# EAGLE design qo-100-pa (EAGLE 9.6.1)
CREVISION: 1; DESIGNER: Joao Silva
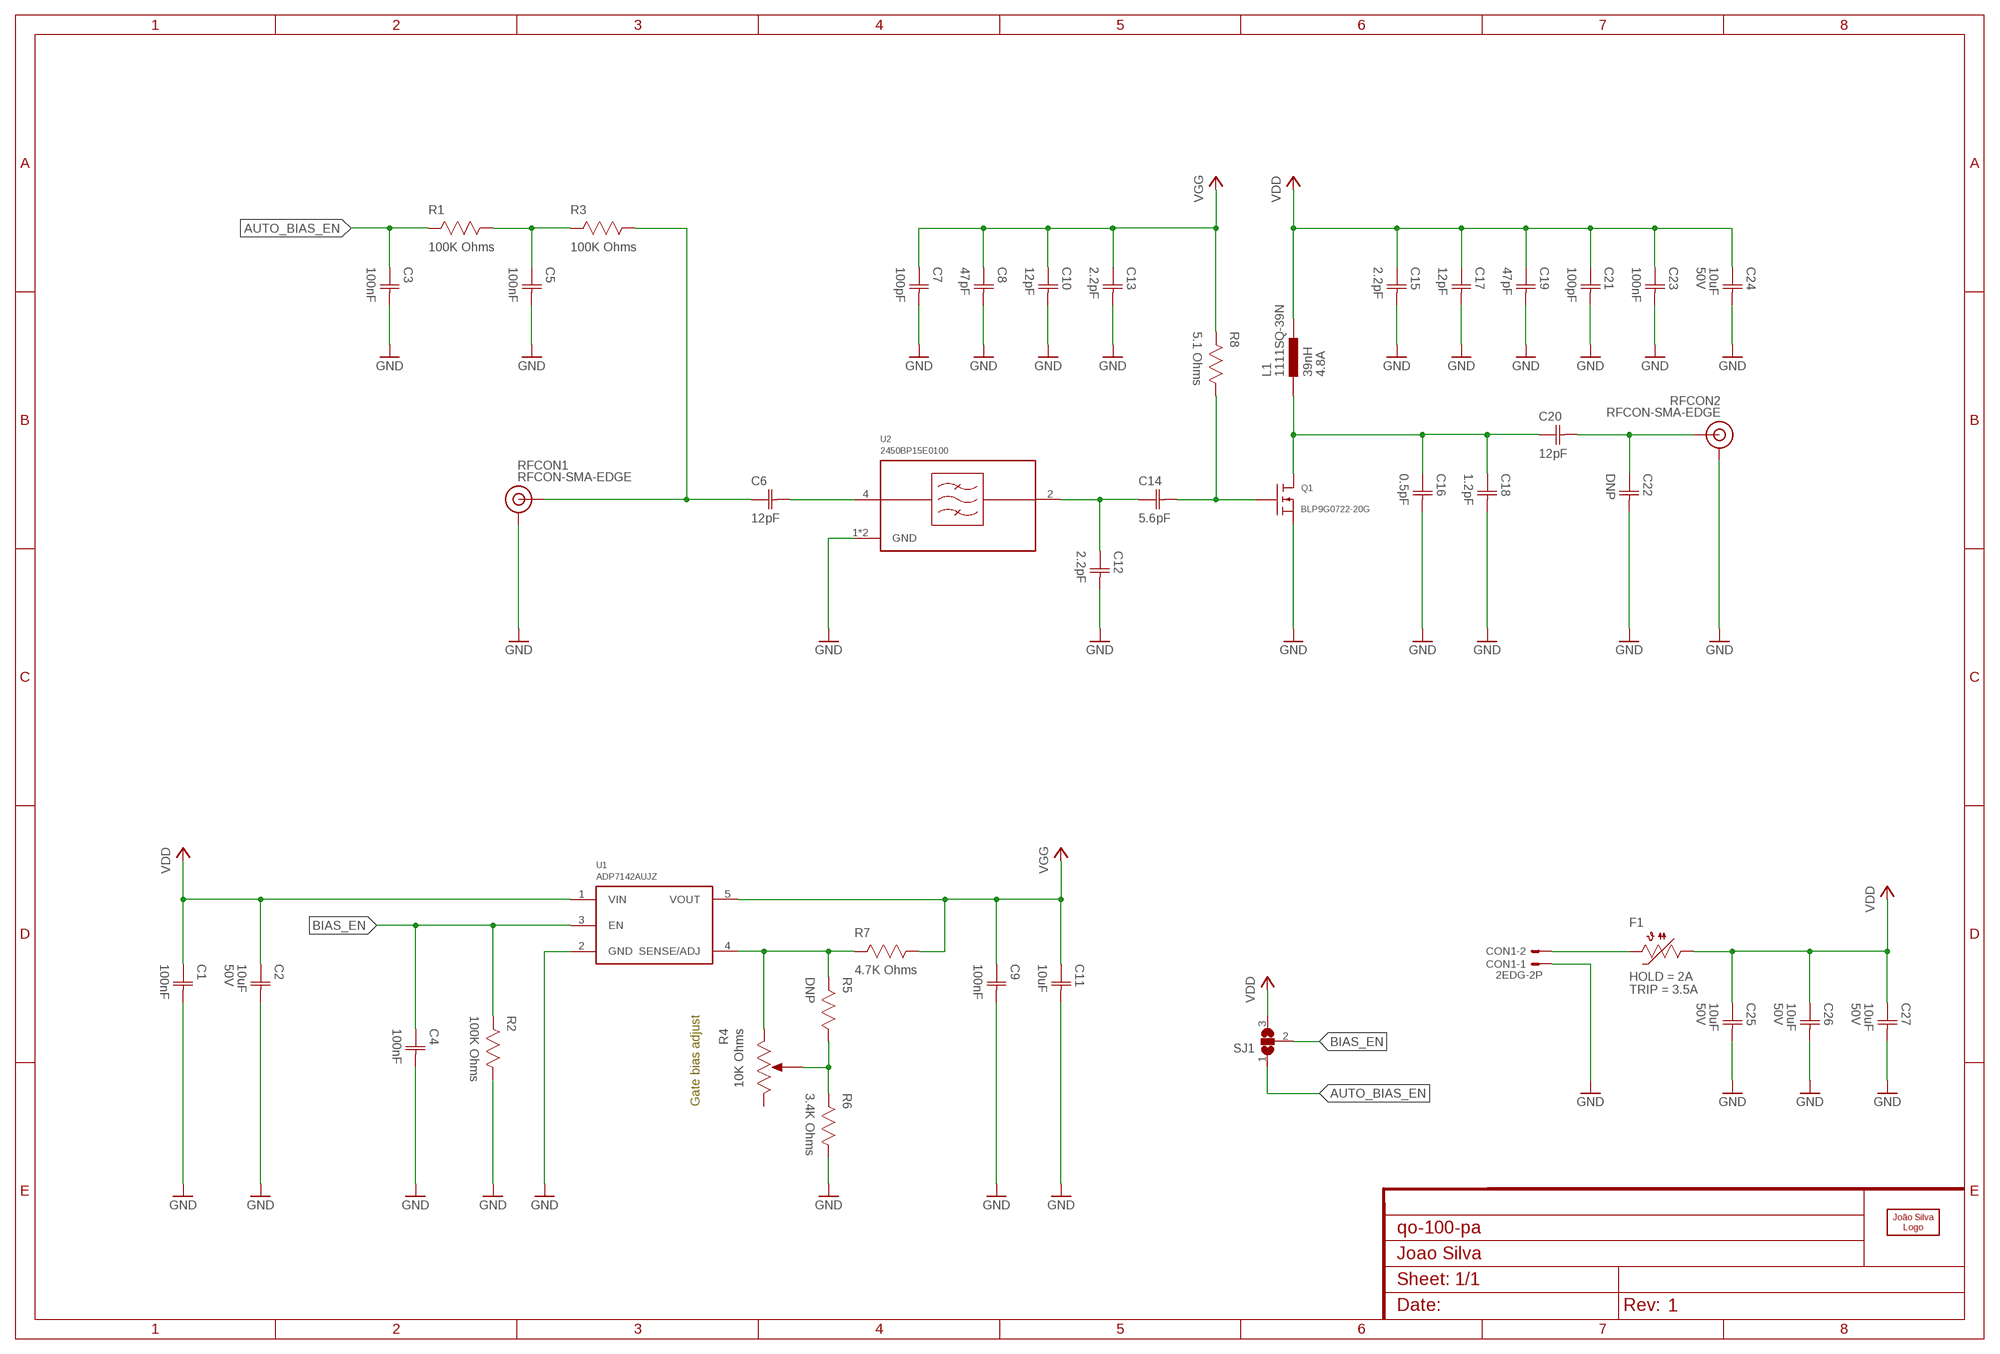
[diagram p0: schematic, sheet 1]

## Parts
C1  100nF  CAPACITOR-0603  [CAP0603]
C2  10uF  CAPACITOR-1206  [CAP1206]
C3  100nF  CAPACITOR-0603  [CAP0603]
C4  100nF  CAPACITOR-0603  [CAP0603]
C5  100nF  CAPACITOR-0603  [CAP0603]
C6  12pF  CAPACITOR-0603  [CAP0603]
C7  100pF  CAPACITOR-0603  [CAP0603]
C8  47pF  CAPACITOR-0603  [CAP0603]
C9  100nF  CAPACITOR-0603  [CAP0603]
C10  12pF  CAPACITOR-0603  [CAP0603]
C11  10uF  CAPACITOR-0603  [CAP0603]
C12  2.2pF  CAPACITOR-0603  [CAP0603]
C13  2.2pF  CAPACITOR-0603  [CAP0603]
C14  5.6pF  CAPACITOR-0603  [CAP0603]
C15  2.2pF  CAPACITOR-0603  [CAP0603]
C16  0.5pF  CAPACITOR-0603  [CAP0603]
C17  12pF  CAPACITOR-0603  [CAP0603]
C18  1.2pF  CAPACITOR-0603  [CAP0603]
C19  47pF  CAPACITOR-0603  [CAP0603]
C20  12pF  CAPACITOR-0603  [CAP0603]
C21  100pF  CAPACITOR-0603  [CAP0603]
C22  DNP  CAPACITOR-0603  [CAP0603]
C23  100nF  CAPACITOR-0603  [CAP0603]
C24  10uF  CAPACITOR-1206  [CAP1206]
C25  10uF  CAPACITOR-1206  [CAP1206]
C26  10uF  CAPACITOR-1206  [CAP1206]
C27  10uF  CAPACITOR-1206  [CAP1206]
CON1  2EDG-2P  [2EDG-2P]
F1  PTC1206  [1206]
L1  39nH  1111SQ-39N  [1111SQ]
LOGO1  JS-10MM  [JS_10MM]
Q1  BLP9G0722-20G  [SOT1483-1]
R1  100K Ohms  RESISTOR-0603  [RES0603]
R2  100K Ohms  RESISTOR-0603  [RES0603]
R3  100K Ohms  RESISTOR-0603  [RES0603]
R4  10K Ohms  POTENTIOMETER-SMD-3X3  [POT3MM]
R5  DNP  RESISTOR-0603  [RES0603]
R6  3.4K Ohms  RESISTOR-0603  [RES0603]
R7  4.7K Ohms  RESISTOR-0603  [RES0603]
R8  5.1 Ohms  RESISTOR-0603  [RES0603]
RFCON1  RFCON-SMA-EDGE  [SMA-EDGE]
RFCON2  RFCON-SMA-EDGE  [SMA-EDGE]
SJ1  SJ2S  [SJ2_S]
U1  ADP7142AUJZ  [SOT23-5]
U2  2450BP15E0100  [2450BP15E0100]

## Nets
AUTO_BIAS_EN: C3.1(C1) R1.2 SJ1.1
BIAS_EN: C4.1(C1) R2.2 SJ1.2 U1.3(EN)
GND: C1.2(C2) C2.2(C2) C3.2(C2) C4.2(C2) C5.2(C2) C7.2(C2) C8.2(C2) C9.2(C2) C10.2(C2) C11.2(C2) C12.2(C2) C13.2(C2) C15.2(C2) C16.2(C2) C17.2(C2) C18.2(C2) C19.2(C2) C21.2(C2) C22.2(C2) C23.2(C2) C24.2(C2) C25.2(C2) C26.2(C2) C27.2(C2) CON1.P$1 Q1.3@0(S) Q1.3@1(S) Q1.3@2(S) R2.1 R6.1 RFCON1.GND@0(GND) RFCON1.GND@1(GND) RFCON1.GND@2(GND) RFCON1.GND@3(GND) RFCON2.GND@0(GND) RFCON2.GND@1(GND) RFCON2.GND@2(GND) RFCON2.GND@3(GND) U1.2(GND) U2.1(GND) U2.3(GND)
N$1 [HV isolation]: CON1.P$2 F1.2
N$2: C14.2(C2) Q1.2(G) R8.1
N$3: C16.1(C1) C18.1(C1) C20.1(C1) L1.1 Q1.1(D)
N$4: C20.2(C2) C22.1(C1) RFCON2.SIG(SIGNAL)
N$5: C12.1(C1) C14.1(C1) U2.2(RFOUT)
N$6: C6.2(C2) U2.4(RFIN)
N$7: C5.1(C1) R1.1 R3.2
N$8: R4.1(CCW) R5.2 R7.2 U1.4(SENSE/ADJ)
N$9: R4.2(WIPER) R5.1 R6.2
N$12: C6.1(C1) R3.1 RFCON1.SIG(SIGNAL)
VDD [HV isolation]: C1.1(C1) C2.1(C1) C15.1(C1) C17.1(C1) C19.1(C1) C21.1(C1) C23.1(C1) C24.1(C1) C25.1(C1) C26.1(C1) C27.1(C1) F1.1 L1.2 SJ1.3 U1.1(VIN)
VGG: C7.1(C1) C8.1(C1) C9.1(C1) C10.1(C1) C11.1(C1) C13.1(C1) R7.1 R8.2 U1.5(VOUT)
Unconnected: R4.3(CW)

## Notes on the sheet
- Gate bias adjust

## Library data of the parts
C1 C3-C23 = Capacitor:CAPACITOR
C2 C24-C27 = Capacitor:CAPACITOR; VOLTAGE: 50V
CON1 = Generic Connector:2EDG-2P
F1 = PTC Fuses:PTC; HOLD: 2A; TRIP: 3.5A
L1 = Coilcraft:1111SQ-; CURRENT: 4.8A; REF: 1111SQ-39N
LOGO1 = Silkscreen:JS
Q1 = Ampleon:BLP9G0722-20
R1-R3 R5-R8 = Resistor:RESISTOR
R4 = Potentiometer:POTENTIOMETER
RFCON1 RFCON2 = RF Connector:RFCON
SJ1 = Solder Jumper:SJ2
U1 = Analog Devices:ADP7142AUJZ*
U2 = Generic Filter:2450BP15E0100

## Net classes
1 HV isolation: clearance 0.2 mm

## Board
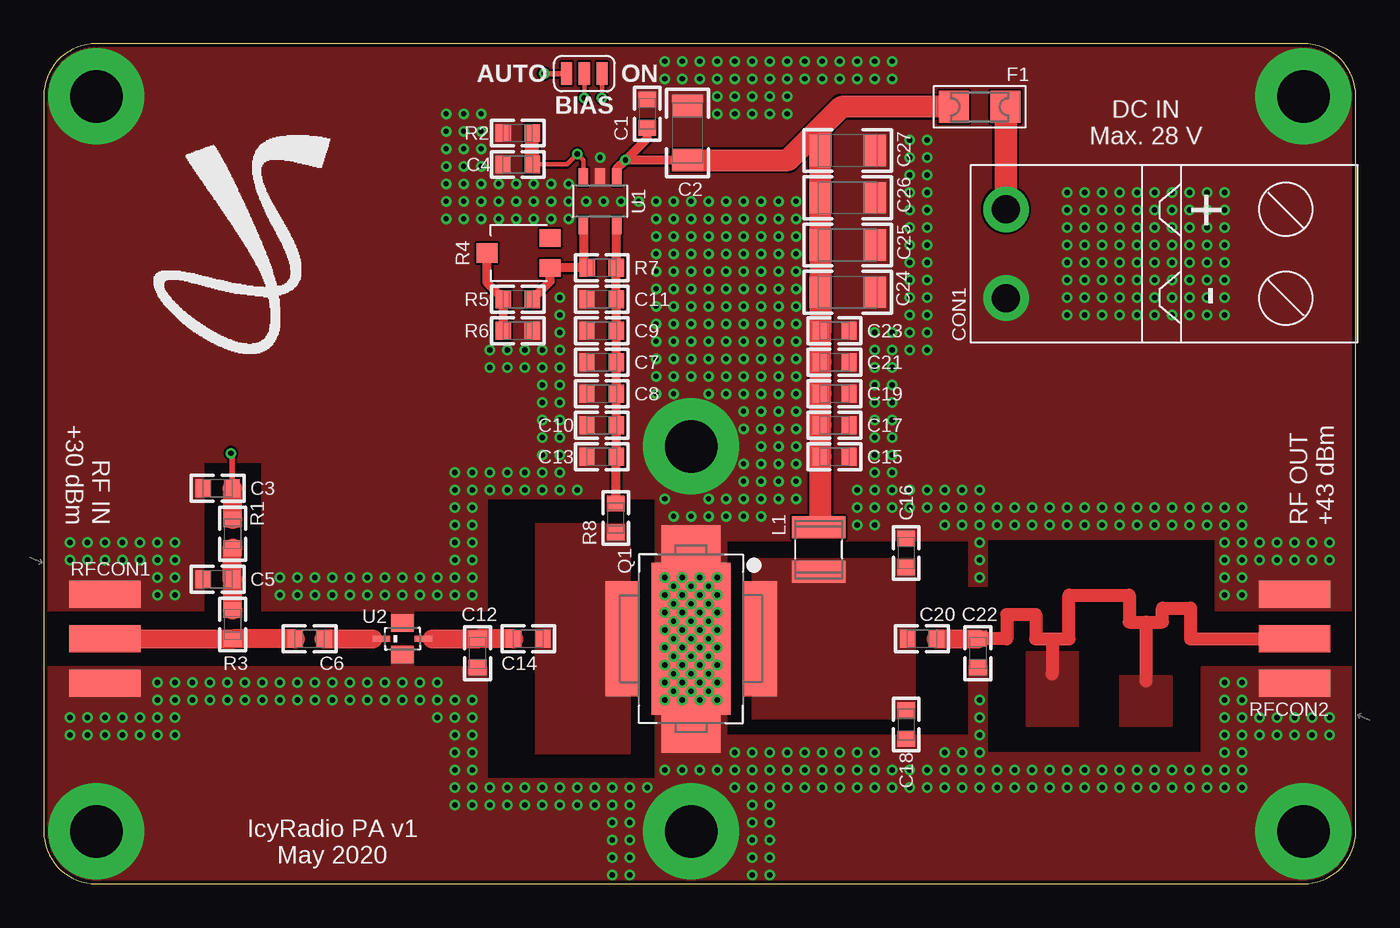
[diagram p1: board, top side]
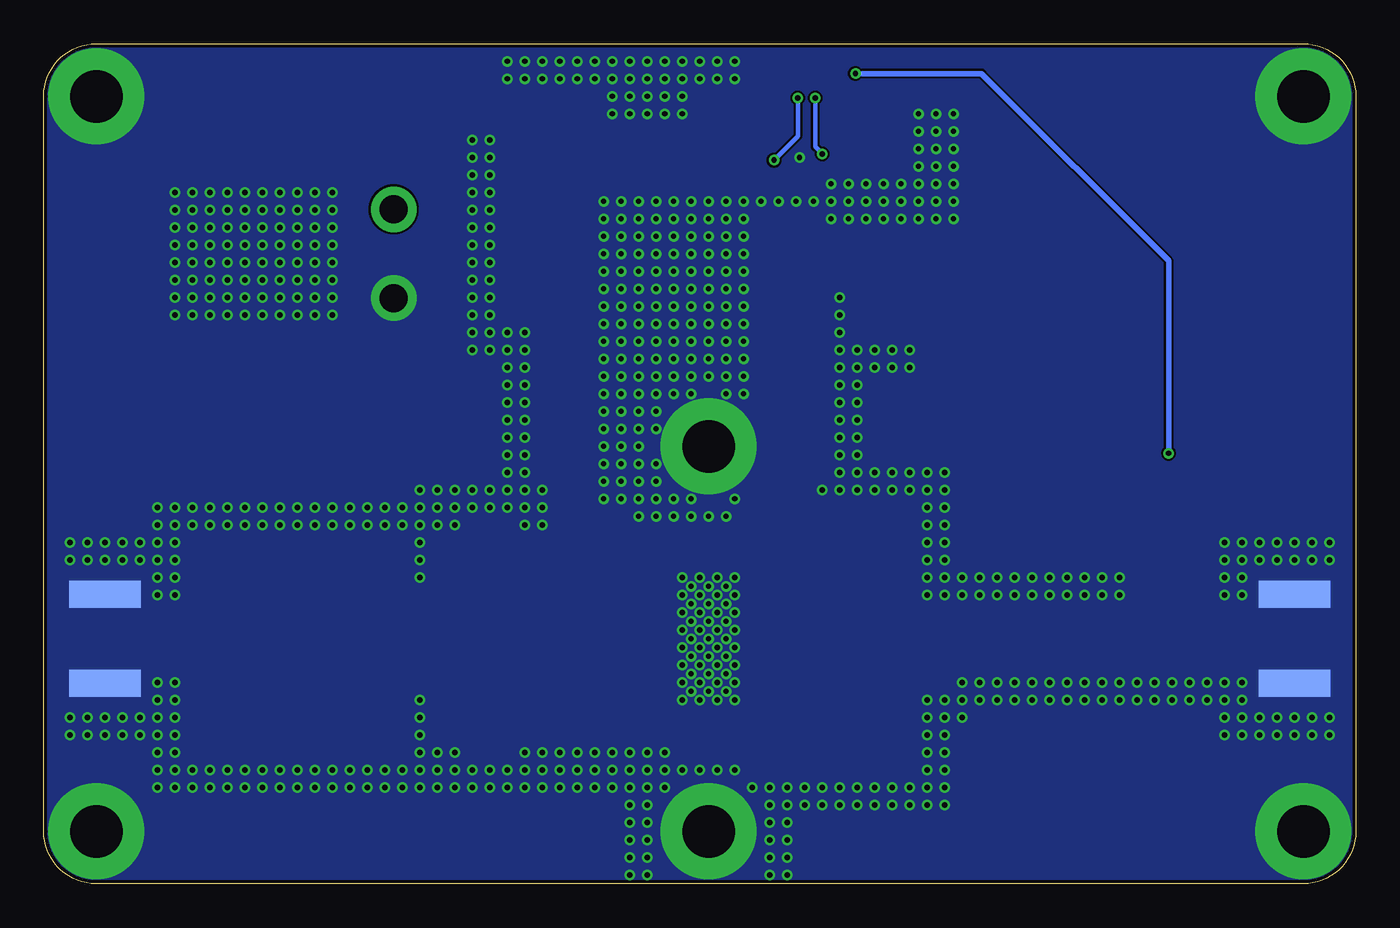
[diagram p2: board, bottom side, seen from below]

Size 75 x 48 mm. Coordinates in mm from the lower left corner, seen from the top.
Outline: 72,48 3,48 arc90 0,45 0,3 arc90 3,0 72,0 arc90 75,3 75,45 arc90 72,48
Copper layers (1*16): Top 0.035mm / dielectric 1.6mm / Bottom 0.035mm
Design rules "jlcpcb_2layer": minimum track width 5mil, minimum drill 0.3mm, track to track 5mil, track to pad 5mil, pad to pad 5mil, via to via 5mil, smd to smd 5mil, copper to edge 0.2mm, drill to drill 5mil, minimum pad ring 3mil, minimum via ring 3mil, stop-mask expansion 0.075mm, vias tented up to drill 10mm, thermal gap 5mil

### Footprints (pad centres in the part's own frame; a part is rotated, then mirrored left to right if it is on the bottom)
CAP0603 = smd 0.889 x 1.016: 1 -0.819,0; 2 0.819,0
CAP1206 = smd 1.27 x 1.778: 1 -1.549,0; 2 1.549,0
2EDG-2P = drill 1.6 pad 2.6: P$1 -2.54,0; P$2 2.54,0
1206 = smd 1.7 x 1.803: 1 -1.472,0; 2 1.472,0
1111SQ = smd 1.27 x 3.05: 1 -1.27,0; 2 1.27,0
SOT1483-1 = smd 6.55 x 1.9: 1 0,-3.95; 2 0,3.95 | smd 2.4 x 3.38: 3@0 5.3,0; 3@1 -5.3,0 | smd 8.7 x 4.5: 3@2 0,0
RES0603 = smd 0.889 x 1.016: 1 -0.819,0; 2 0.819,0
POT3MM = smd 1 x 1.2: 1 -0.85,-1.8; 3 0.85,-1.8 | smd 1.1 x 1.2: 2 0,1.8
SMA-EDGE = smd 1.524 x 4.064: GND@0 -2.54,0; GND@1 2.54,0; SIG 0,0 | smd 1.524 x 4.064 bottom: GND@2 -2.54,0; GND@3 2.54,0
SJ2_S = smd 0.635 x 1.27: 1 -1.016,0; 2 0,0; 3 1.016,0
SOT23-5 = smd 1 x 0.55: 1 -1.4,0.95; 2 -1.4,0; 3 -1.4,-0.95; 4 1.4,-0.95; 5 1.4,0.95
2450BP15E0100 = smd 1.3 x 1: 1 0,0.9; 3 0,-0.9 | smd 1 x 0.35: 2 1.2,0; 4 -1.2,0

### Placement (x,y rotation side)
C1  34.5,44 90 top
C2  36.8,42.9 90 top
C3  9.95,22.6 180 top
C4  27.1,41.1 180 top
C5  9.95,17.4 180 top
C6  15.2,14 0 top
C7  31.9,29.8 180 top
C8  31.9,28 180 top
C9  31.9,31.6 180 top
C10  31.9,26.2 180 top
C11  31.9,33.4 180 top
C12  24.8,13.18 270 top
C13  31.9,24.4 180 top
C14  27.7,14 0 top
C15  45.2,24.4 0 top
C16  49.3,18.9 90 top
C17  45.2,26.2 0 top
C18  49.3,9.1 270 top
C19  45.2,28 0 top
C20  50.2,14 0 top
C21  45.2,29.8 0 top
C22  53.4,13.18 270 top
C23  45.2,31.6 0 top
C24  45.95,33.8 0 top
C25  45.95,36.5 0 top
C26  45.95,39.2 0 top
C27  45.95,41.9 0 top
CON1  55,36 90 top
F1  53.5,44.4 0 top
L1  44.3,19.1 90 top
LOGO1  17.3,43.3 0 top
Q1  37,14 90 top
R1  10.8,20 90 top
R2  27.1,42.9 0 top
R3  10.8,14.81 90 top
R4  27.15,36.05 90 top
R5  27.1,33.4 0 top
R6  27.1,31.6 180 top
R7  31.9,35.2 180 top
R8  32.7,20.9 90 top
RFCON1  3.5,14 270 top
RFCON2  71.5,14 90 top
SJ1  30.9,46.3 0 top
U1  31.8,39 270 top
U2  20.5,14 0 top

### Tracks (layer width: path | path; a pad name or v marks a point on that pad's centre or on a via)
AUTO_BIAS_EN  (via drill 0.3)
  Top 0.305: v28.6,46.3 SJ1.1 | C3.1 10.77,24.53 v10.7,24.6
  Top 1.1: R1.2 10.8,22.57 C3.1
  Bottom 0.305: v10.7,24.6 10.7,35.6 21.4,46.3 v28.6,46.3
BIAS_EN  (via drill 0.3)
  Top 0.254: U1.3 30.85,41.35 v30.5,41.7 29.9,41.1 C4.1 | v30.9,44.9 SJ1.2
  Top 0.813: C4.1 R2.2
  Bottom 0.254: v30.5,41.7 30.9,42.1 v30.9,44.9
GND  (via drill 0.3, 3 pad 5.5)
  other vias: 39,22 35.5,17.5 36.5,17.5 37.5,17.5 38.5,17.5 38,17 37,17 36,17 21.5,11.5 22.5,11.5 18.5,11.5 19.5,11.5 20.5,11.5 26.5,4.5 26.5,5.5 24.5,5.5 24.5,6.5 24.5,7.5 24.5,8.5 24.5,9.5 25.5,4.5 25.5,5.5 23.5,5.5 23.5,6.5 23.5,7.5 23.5,8.5 23.5,9.5 23.5,10.5 24.5,10.5 19.5,10.5 20.5,10.5 21.5,10.5 22.5,10.5 14.5,10.5 15.5,10.5 16.5,10.5 17.5,10.5 18.5,10.5 11.5,11.5 12.5,11.5 13.5,11.5 14.5,11.5 15.5,11.5 6.5,11.5 7.5,11.5 8.5,11.5 9.5,11.5 10.5,11.5 16.5,11.5 17.5,11.5 6.5,10.5 7.5,10.5 8.5,10.5 9.5,10.5 10.5,10.5 11.5,10.5 12.5,10.5 13.5,10.5 23.5,17.5 24.5,17.5 21.5,17.5 22.5,17.5 18.5,17.5 19.5,17.5 20.5,17.5 23.5,19.5 24.5,19.5 24.5,18.5 23.5,18.5 23.5,16.5 24.5,16.5 19.5,16.5 20.5,16.5 21.5,16.5 22.5,16.5 14.5,16.5 15.5,16.5 16.5,16.5 17.5,16.5 18.5,16.5 13.5,17.5 14.5,17.5 15.5,17.5 16.5,17.5 17.5,17.5 13.5,16.5 29.5,22.5 30.5,22.5 27.5,22.5 25.5,22.5 23.5,23.5 23.5,22.5 23.5,21.5 23.5,20.5 28.5,22.5 26.5,22.5 24.5,23.5 24.5,22.5 24.5,21.5 24.5,20.5 35,29 36,29 37,29 38,29 39,29 39,28 35,28 35,31 36,31 37,31 38,31 39,31 39,30 38,30 37,30 36,30 35,30 35,33 36,33 37,33 38,33 39,33 39,32 38,32 37,32 36,32 35,32 35,35 36,35 37,35 38,35 39,35 39,34 38,34 37,34 36,34 35,34 35,37 36,37 37,37 38,37 39,37 39,36 38,36 37,36 36,36 35,36 28.5,4.5 28.5,5.5 24.5,4.5 27.5,4.5 27.5,5.5 23.5,4.5 47.5,23.5 46.5,21.5 47.5,21.5 47.5,22.5 47.5,24.5 48.5,21.5 48.5,22.5 48.5,23.5 49.5,21.5 49.5,22.5 48.5,24.5 48.5,27.5 48.5,26.5 47.5,27.5 47.5,25.5 48.5,25.5 47.5,26.5 48.5,29.5 47.5,29.5 47.5,28.5 48.5,28.5 38,38 36,38 31.8,41.5 37,38 35,38 35,39 33,39 31,39 34,39 32,39 39,38 38,39 36,39 39,39 37,39 26,40 26,39 27,40 28,40 27,39 28,39 30,40 29,40 30,39 30,38 29,39 29,38 29.5,30.5 27.5,30.5 25.5,30.5 28.5,30.5 26.5,30.5 29.5,29.5 29.5,27.5 27.5,29.5 25.5,29.5 28.5,29.5 28.5,27.5 26.5,29.5 29.5,26.5 29.5,28.5 28.5,26.5 28.5,28.5 29.5,32.5 29.5,25.5 29.5,31.5 28.5,25.5 29.5,24.5 29.5,23.5 27.5,23.5 25.5,23.5 28.5,24.5 28.5,23.5 26.5,23.5 23,38 23,41 24,38 25,38 24,41 25,41 23,40 23,39 24,40 25,40 24,39 25,39 23,44 24,44 25,44 23,43 24,43 25,43 23,42 24,42 25,42 63.5,33.5 64.5,33.5 65.5,33.5 66.5,33.5 67.5,33.5 67.5,32.5 66.5,32.5 65.5,32.5 64.5,32.5 63.5,32.5 63.5,35.5 64.5,35.5 65.5,35.5 66.5,35.5 67.5,35.5 67.5,34.5 66.5,34.5 65.5,34.5 64.5,34.5 63.5,34.5 63.5,37.5 64.5,37.5 65.5,37.5 66.5,37.5 67.5,37.5 67.5,36.5 66.5,36.5 65.5,36.5 64.5,36.5 63.5,36.5 63.5,39.5 64.5,39.5 65.5,39.5 66.5,39.5 67.5,39.5 67.5,38.5 66.5,38.5 65.5,38.5 64.5,38.5 63.5,38.5 58.5,33.5 59.5,33.5 60.5,33.5 61.5,33.5 62.5,33.5 62.5,32.5 61.5,32.5 60.5,32.5 59.5,32.5 58.5,32.5 58.5,35.5 59.5,35.5 60.5,35.5 61.5,35.5 62.5,35.5 62.5,34.5 61.5,34.5 60.5,34.5 59.5,34.5 58.5,34.5 58.5,37.5 59.5,37.5 60.5,37.5 61.5,37.5 62.5,37.5 62.5,36.5 61.5,36.5 60.5,36.5 59.5,36.5 58.5,36.5 58.5,39.5 59.5,39.5 60.5,39.5 61.5,39.5 62.5,39.5 62.5,38.5 61.5,38.5 60.5,38.5 59.5,38.5 58.5,38.5 35.5,10.5 36.5,10.5 37.5,10.5 38.5,10.5 35.5,11.5 36.5,11.5 37.5,11.5 38.5,11.5 38,11 37,11 36,11 35.5,12.5 36.5,12.5 37.5,12.5 38.5,12.5 38,12 37,12 36,12 35.5,13.5 36.5,13.5 37.5,13.5 38.5,13.5 38,13 37,13 36,13 35.5,14.5 36.5,14.5 37.5,14.5 38.5,14.5 38,14 37,14 36,14 35.5,15.5 36.5,15.5 37.5,15.5 38.5,15.5 38,15 37,15 36,15 35.5,16.5 36.5,16.5 37.5,16.5 38.5,16.5 38,16 37,16 36,16 22.5,9.5 6.5,9.5 7.5,9.5 6.5,8.5 7.5,8.5 1.5,9.5 2.5,9.5 3.5,9.5 4.5,9.5 5.5,9.5 1.5,8.5 2.5,8.5 3.5,8.5 4.5,8.5 5.5,8.5 33.5,0.5 34.5,5.5 32.5,5.5 33.5,4.5 33.5,5.5 31.5,5.5 40.5,0.5 33.5,2.5 32.5,4.5 33.5,1.5 33.5,3.5 31.5,4.5 30.5,4.5 29.5,4.5 29.5,5.5 30.5,5.5 50.5,5.5 48.5,5.5 49.5,5.5 47.5,5.5 52.5,5.5 51.5,5.5 58.5,5.5 56.5,5.5 57.5,5.5 55.5,5.5 60.5,5.5 59.5,5.5 53.5,5.5 54.5,5.5 7.5,18.5 6.5,18.5 7.5,16.5 7.5,17.5 6.5,16.5 6.5,17.5 7.5,19.5 6.5,19.5 5.5,19.5 4.5,19.5 5.5,18.5 4.5,18.5 1.5,19.5 1.5,18.5 3.5,19.5 2.5,19.5 3.5,18.5 2.5,18.5 36.5,6.5 35.5,6.5 50.5,6.5 48.5,6.5 49.5,6.5 47.5,6.5 52.5,6.5 51.5,6.5 45.5,6.5 46.5,6.5 58.5,6.5 56.5,6.5 57.5,6.5 55.5,6.5 60.5,6.5 59.5,6.5 53.5,6.5 54.5,6.5 42.5,6.5 40.5,6.5 41.5,6.5 39.5,6.5 44.5,6.5 43.5,6.5 37.5,6.5 38.5,6.5 47.5,7.5 52.5,7.5 51.5,7.5 45.5,7.5 46.5,7.5 42.5,7.5 40.5,7.5 41.5,7.5 39.5,7.5 44.5,7.5 43.5,7.5 66.5,5.5 66.5,6.5 67.5,7.5 68.5,7.5 67.5,6.5 68.5,6.5 67.5,5.5 68.5,5.5 67.5,11.5 68.5,11.5 67.5,9.5 68.5,9.5 69.5,9.5 70.5,9.5 71.5,9.5 67.5,8.5 68.5,8.5 69.5,8.5 70.5,8.5 71.5,8.5 72.5,9.5 73.5,9.5 72.5,8.5 73.5,8.5 67.5,10.5 68.5,10.5 61.5,6.5 62.5,6.5 63.5,6.5 64.5,6.5 65.5,6.5 61.5,5.5 62.5,5.5 63.5,5.5 64.5,5.5 65.5,5.5 53.5,9.5 53.5,7.5 53.5,8.5 53.5,10.5 53.5,19.5 53.5,17.5 53.5,18.5 53.5,20.5 52.5,22.5 52.5,21.5 53.5,21.5 53.5,22.5 50.5,22.5 50.5,21.5 51.5,21.5 51.5,22.5 67.5,17.5 68.5,17.5 67.5,16.5 68.5,16.5 67.5,19.5 68.5,19.5 69.5,19.5 70.5,19.5 71.5,19.5 67.5,18.5 68.5,18.5 69.5,18.5 70.5,18.5 71.5,18.5 72.5,19.5 73.5,19.5 72.5,18.5 73.5,18.5 54.5,21.5 55.5,21.5 56.5,21.5 57.5,21.5 58.5,21.5 54.5,20.5 55.5,20.5 56.5,20.5 57.5,20.5 58.5,20.5 59.5,21.5 60.5,21.5 61.5,21.5 62.5,21.5 63.5,21.5 59.5,20.5 60.5,20.5 61.5,20.5 62.5,20.5 63.5,20.5 64.5,21.5 65.5,21.5 66.5,21.5 67.5,21.5 68.5,21.5 64.5,20.5 65.5,20.5 66.5,20.5 67.5,20.5 68.5,20.5 46.5,20.5 47.5,20.5 51.5,20.5 52.5,20.5 40,23 41,23 41,22 40,22 41,25 41,24 40,27 41,27 41,26 40,29 41,29 41,28 40,28 40,31 41,31 41,30 40,30 40,33 41,33 41,32 40,32 40,35 41,35 41,34 40,34 40,37 41,37 41,36 40,36 40,38 41,38 40,39 41,39 48.5,31.5 47.5,31.5 47.5,30.5 48.5,30.5 29.5,33.5 26,38 27,38 28,38 40.5,3.5 40.5,4.5 40.5,1.5 40.5,2.5 41.5,2.5 41.5,1.5 32.5,1.5 32.5,0.5 32.5,2.5 32.5,3.5 41.5,3.5 41.5,4.5 50.5,42.5 49.5,42.5 50.5,39.5 49.5,39.5 49.5,38.5 50.5,38.5 50.5,41.5 49.5,41.5 49.5,40.5 50.5,40.5 49.5,30.5 50.5,30.5 50.5,33.5 50.5,32.5 49.5,33.5 49.5,31.5 50.5,31.5 49.5,32.5 50.5,35.5 49.5,35.5 49.5,34.5 50.5,34.5 50.5,37.5 49.5,37.5 49.5,36.5 50.5,36.5 42,23 43,23 43,22 42,22 42,25 43,25 43,24 42,24 42,27 43,27 43,26 42,26 42,29 43,29 43,28 42,28 42,31 43,31 43,30 42,30 42,33 43,33 43,32 42,32 42,35 43,35 43,34 42,34 43,36 42,36 41,21 40,21 39,21 38,21 37,21 36,21 46.5,22.5 42.5,47 43.5,47 43.5,46 42.5,46 42.5,45 42.5,44 38.5,46 36.5,46 37.5,46 35.5,46 35.5,47 39.5,46 38.5,47 36.5,47 39.5,47 37.5,47 40.5,46 41.5,46 40.5,47 41.5,47 38.5,44 39.5,44 38.5,45 39.5,45 40.5,44 41.5,44 40.5,45 41.5,45 47.5,46 45.5,46 46.5,46 44.5,46 44.5,47 48.5,46 47.5,47 45.5,47 48.5,47 46.5,47 42,37 43,37 42,39 43,39 43,38 42,38 40.5,5.5 39.5,5.5 45.5,5.5 46.5,5.5 42.5,5.5 41.5,5.5 44.5,5.5 43.5,5.5 41.5,0.5 37,3 3,3 72,3 72,45 3,45 37,25 38,28 35.5,22 38,22 40,24 40,26 36,28
  pour Top (rank 6, no thermals): -2,15.6 -2,50 77,50 77,15.6 67,15.6 67,19.7 53.9,19.7 53.9,17 52.9,17 52.9,19.6 39,19.6 39,8.5 52.9,8.5 52.9,12.5 53.9,12.5 53.9,7.5 66.2,7.5 66.2,12.4 77,12.4 77,-1.5 -2,-1.5 -2,12.4 19.9,12.4 19.9,13.5 21.1,13.5 21.1,12.4 25.3,12.4 25.3,6 35,6 35,22 25.3,22 25.3,15.6 21.1,15.6 21.1,14.5 19.9,14.5 19.9,15.6 12.5,15.6 12.5,24.1 9.1,24.1 9.1,15.6
  pour Bottom (rank 6, no thermals): -4,-4 79,-4 79,52 -4,52
N$1
  Top 1.275: CON1.P$2 55,44.37 F1.2
N$2
  pour Top (no thermals): 33.5,7.45 33.5,20.55 28.1,20.55 28.1,7.45
N$3
  pour Top (no thermals): 40.5,9.45 49.8,9.45 49.8,18.55 40.5,18.55
N$4
  Top 0.75: 57.65,14 56.7,14 56.7,15.4 55.05,15.4 55.05,14 C22.1 | 57.65,14 58.6,14 58.6,16.5 62.05,16.5 62.05,14.95 63,14.95 | 63,14.95 63.95,14.95 63.95,15.75 65.55,15.75 65.55,14 RFCON2.SIG | 63,14.95 63,11.57 | 57.65,14 57.65,12
  Top 1.1: C20.2 C22.1
  pour Top: 61.55,11.9 64.45,11.9 64.45,9 61.55,9
  pour Top: 56.2,13.25 59.1,13.25 59.1,9 56.2,9
N$5
  Top 0.406: U2.2 22.2,14
  Top 1.1: 22.2,14 C12.1 | C14.1 C12.1 | C12.1
N$6
  Top 0.406: 18.8,14 U2.4
  Top 1.1: C6.2 18.8,14
N$7
  Top 1.1: 10.78,15.65 R3.2 10.8,17.37 C5.1 10.77,19.15 R1.1
N$8
  Top 0.508: U1.4 30.85,35.43 R7.2 R4.1 28.95,34.43 R5.2
N$9
  Top 0.508: R4.2 25.35,34.33 R5.1 R6.2
N$12
  Top 1.1: RFCON1.SIG R3.1 | R3.1 | C6.1 R3.1
VDD  (via drill 0.3)
  Top 0.254: SJ1.3 31.92,44.92 v31.9,44.9
  Top 0.508: U1.1 32.75,40.85 v33.25,41.35 | C2.1 v33.25,41.35 | v33.25,41.35 34.5,42.6 C1.1
  Top 1.27: F1.1 45.6,44.4 44.4,43.2 | 44.4,43.2 C27.1 C26.1 C25.1 C24.1 44.4,31.62 | 44.4,31.62 C23.1 | C21.1 44.4,29.82 | 44.4,29.82 44.4,31.62 | C19.1 44.4,28.02 | 44.4,28.02 44.4,29.82 | C17.1 44.4,26.22 | 44.4,26.22 44.4,28.02 | C15.1 44.4,24.42 | 44.4,24.42 44.4,26.22 | L1.2 44.4,20.47 44.4,24.42 | C2.1 42.55,41.35 44.4,43.2
  Bottom 0.254: v31.9,44.9 31.9,42.7 v33.25,41.35
VGG
  Top 0.508: R8.2 32.7,24.38 C13.1 C10.1 C8.1 C7.1 C9.1 C11.1 R7.1 32.75,35.23 U1.5
  Top 0.813: R8.2 32.72,21.74

### Text on the board
tPlace: AUTO | ON | BIAS | DC IN / Max. 28 V | + | - | RF IN / +30 dBm | RF OUT / +43 dBm | IcyRadio PA v1 / May 2020